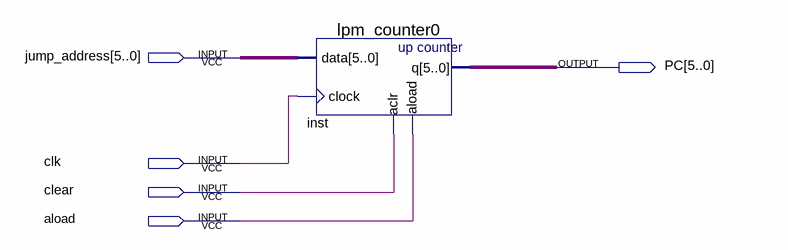
[diagram p0: schematic sheet]
// Quartus schematic PC_conuter.bdf as structural Verilog: 1 symbols, 5 pins
module PC_conuter (
  input  [5:0] jump_address,
  input  clk,
  input  clear,
  input  aload,
  output [5:0] PC
);

  lpm_counter0 inst (.data(jump_address), .clock(clk), .aclr(clear), .aload(aload), .q(PC));
endmodule
